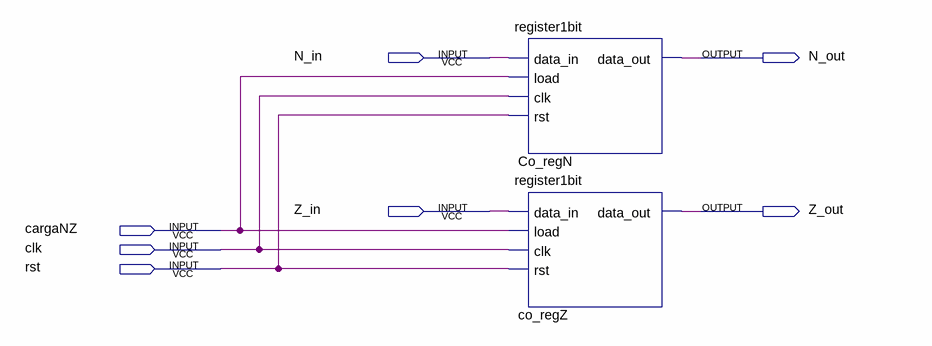
[diagram p0: schematic sheet]
// Quartus schematic regNZ.bdf as structural Verilog: 2 symbols, 7 pins
module regNZ (
  input  N_in,
  input  Z_in,
  input  cargaNZ,
  input  clk,
  input  rst,
  output N_out,
  output Z_out
);

  register1bit Co_regN (.data_in(N_in), .load(cargaNZ), .clk(clk), .rst(rst), .data_out(N_out));
  register1bit co_regZ (.data_in(Z_in), .load(cargaNZ), .clk(clk), .rst(rst), .data_out(Z_out));
endmodule
